# EAGLE design HFL Keep (EAGLE 9.6.2)
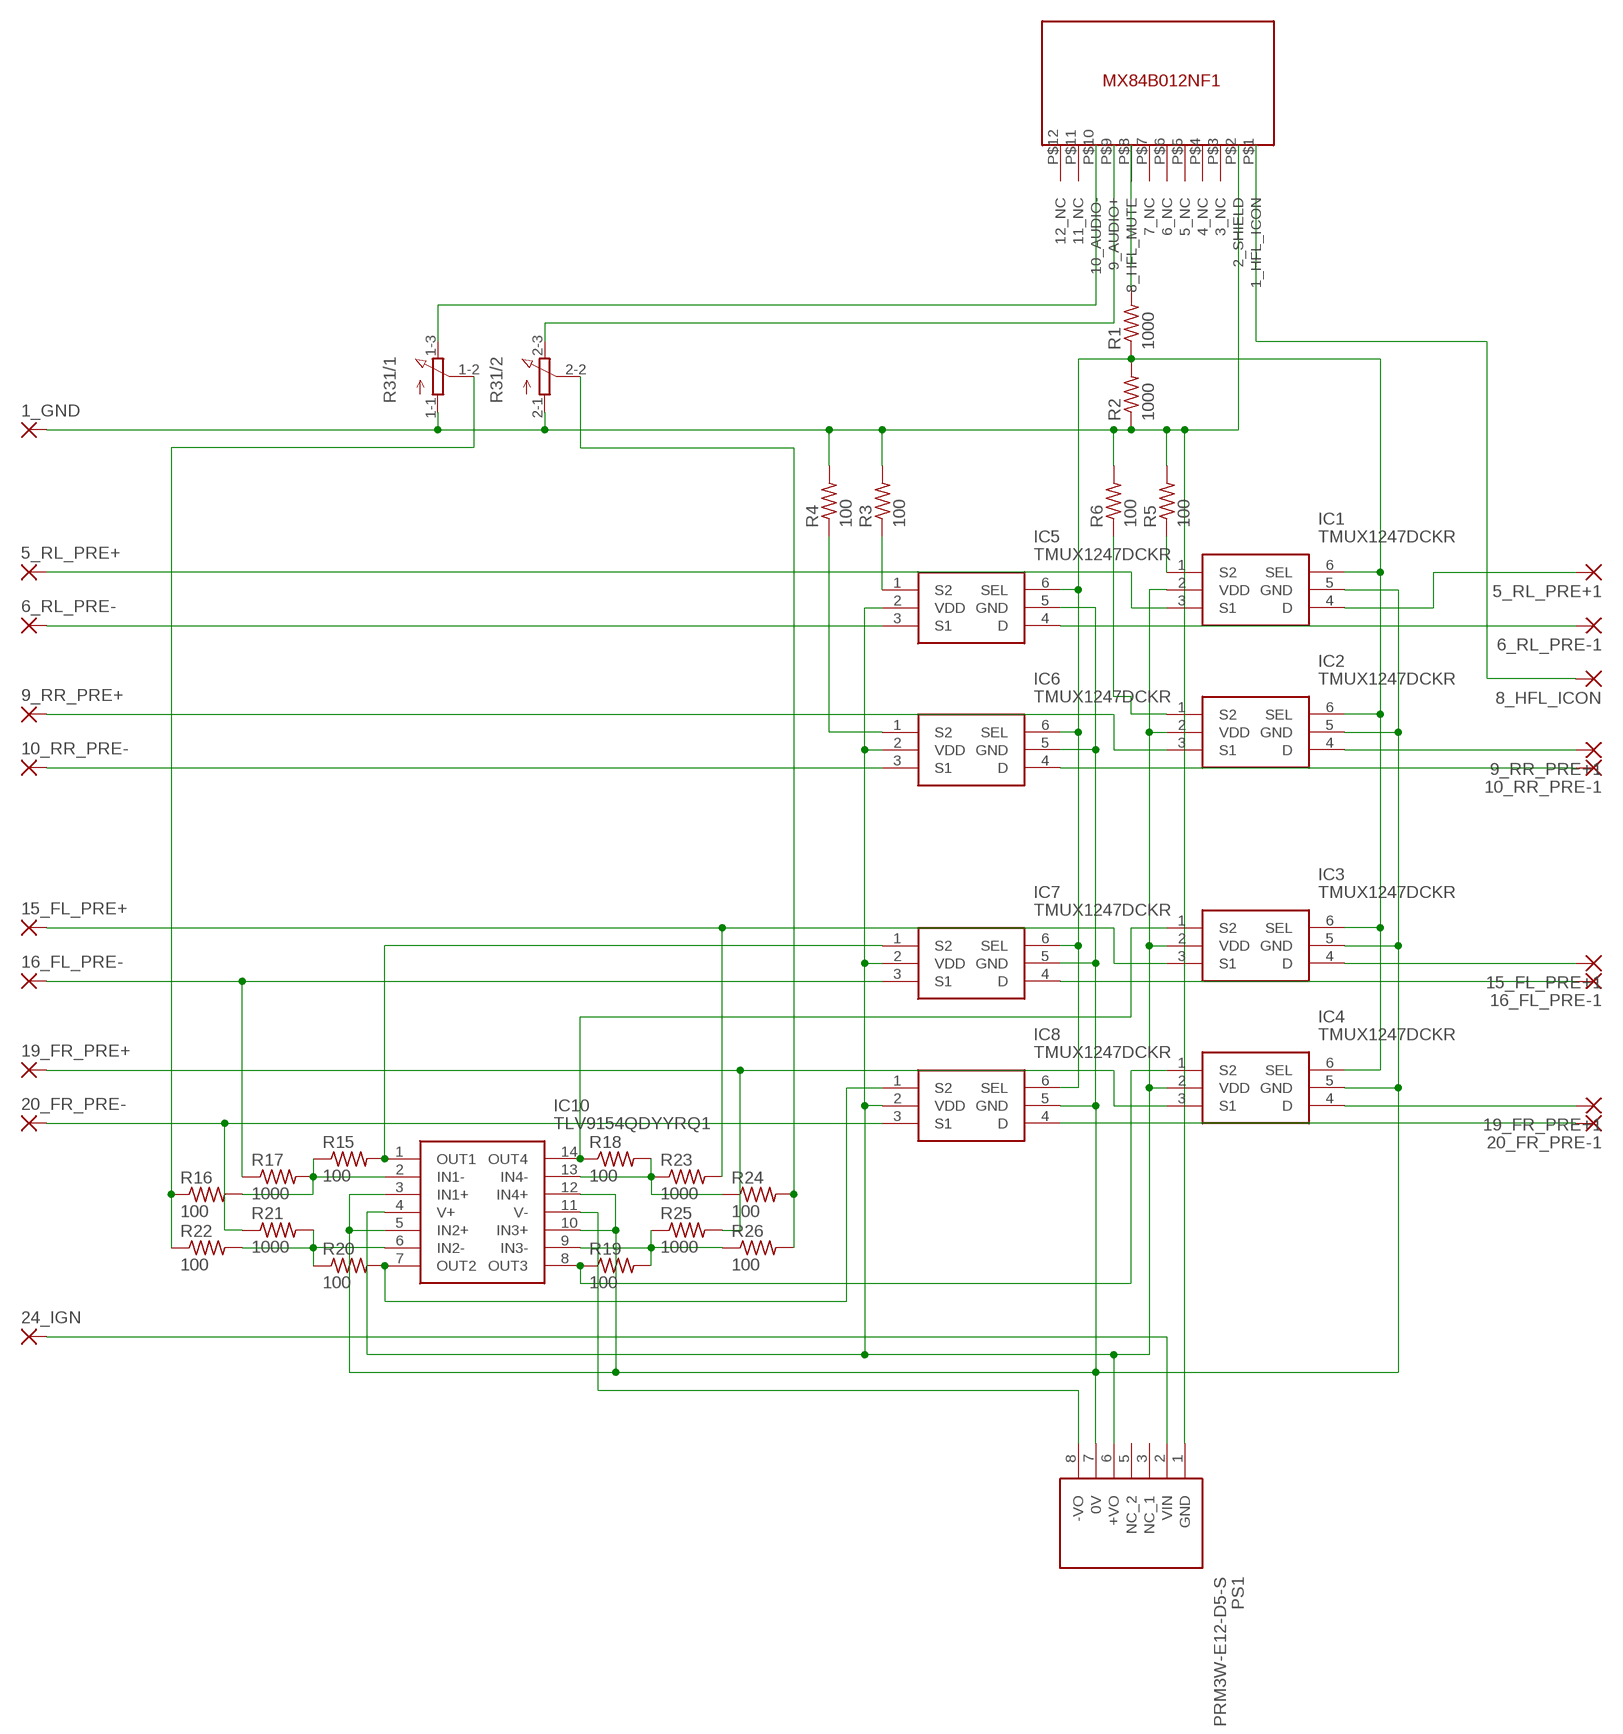
[diagram p0: schematic, sheet 1]

## Parts
1_GND  3,81/1,4  [3,81/1,4]
5_RL_PRE+  3,81/1,4  [3,81/1,4]
5_RL_PRE+1  3,81/1,4  [3,81/1,4]
6_RL_PRE-  3,81/1,4  [3,81/1,4]
6_RL_PRE-1  3,81/1,4  [3,81/1,4]
8_HFL_ICON  3,81/1,4  [3,81/1,4]
9_RR_PRE+  3,81/1,4  [3,81/1,4]
9_RR_PRE+1  3,81/1,4  [3,81/1,4]
10_RR_PRE-  3,81/1,4  [3,81/1,4]
10_RR_PRE-1  3,81/1,4  [3,81/1,4]
15_FL_PRE+  3,81/1,4  [3,81/1,4]
15_FL_PRE+1  3,81/1,4  [3,81/1,4]
16_FL_PRE-  3,81/1,4  [3,81/1,4]
16_FL_PRE-1  3,81/1,4  [3,81/1,4]
19_FR_PRE+  3,81/1,4  [3,81/1,4]
19_FR_PRE+1  3,81/1,4  [3,81/1,4]
20_FR_PRE-  3,81/1,4  [3,81/1,4]
20_FR_PRE-1  3,81/1,4  [3,81/1,4]
24_IGN  3,81/1,4  [3,81/1,4]
IC1  TMUX1247DCKR  [SOT65P210X110-6N]
IC2  TMUX1247DCKR  [SOT65P210X110-6N]
IC3  TMUX1247DCKR  [SOT65P210X110-6N]
IC4  TMUX1247DCKR  [SOT65P210X110-6N]
IC5  TMUX1247DCKR  [SOT65P210X110-6N]
IC6  TMUX1247DCKR  [SOT65P210X110-6N]
IC7  TMUX1247DCKR  [SOT65P210X110-6N]
IC8  TMUX1247DCKR  [SOT65P210X110-6N]
IC10  TLV9154QDYYRQ1  [SOP50P326X110-14N]
PS1  PRM3W-E12-D5-S  [PRM3WE12D5S]
R1  1000  R-US_0204/7  [0204/7]
R2  1000  R-US_0204/7  [0204/7]
R3  100  R-US_0204/7  [0204/7]
R4  100  R-US_0204/7  [0204/7]
R5  100  R-US_0204/7  [0204/7]
R6  100  R-US_0204/7  [0204/7]
R15  100  R-US_0204/7  [0204/7]
R16  100  R-US_0204/7  [0204/7]
R17  1000  R-US_0204/7  [0204/7]
R18  100  R-US_0204/7  [0204/7]
R19  100  R-US_0204/7  [0204/7]
R20  100  R-US_0204/7  [0204/7]
R21  1000  R-US_0204/7  [0204/7]
R22  100  R-US_0204/7  [0204/7]
R23  1000  R-US_0204/7  [0204/7]
R24  100  R-US_0204/7  [0204/7]
R25  1000  R-US_0204/7  [0204/7]
R26  100  R-US_0204/7  [0204/7]
R31  3RP/1610G  [3RP/1610G]
U$1  MX84B012NF1  [MX84B012NF1]

## Nets
N$1: 6_RL_PRE-1.1(P) IC5.4(D)
N$2: IC5.1(S2) R3.1
N$3: 1_GND.1(P) PS1.1(GND) R2.1 R3.2 R4.2 R5.2 R6.2 R31.1-1(/1:A) R31.2-1(/2:A) U$1.P$2(2_SHIELD)
N$4: IC6.1(S2) R4.1
N$5: IC2.1(S2) R6.1
N$6: 8_HFL_ICON.1(P) U$1.P$1(1_HFL_ICON)
N$7: IC1.1(S2) R5.1
N$8: 15_FL_PRE+.1(P) IC3.3(S1) R23.2
N$9: 5_RL_PRE+1.1(P) IC1.4(D)
N$10: IC1.6(SEL) IC2.6(SEL) IC3.6(SEL) IC4.6(SEL) IC5.6(SEL) IC6.6(SEL) IC7.6(SEL) IC8.6(SEL) R1.1 R2.2
N$11: 9_RR_PRE+1.1(P) IC2.4(D)
N$12: R16.1 R22.1 R31.1-2(/1:S)
N$13: IC1.2(VDD) IC2.2(VDD) IC3.2(VDD) IC4.2(VDD) IC5.2(VDD) IC6.2(VDD) IC7.2(VDD) IC8.2(VDD) IC10.4(V+) PS1.6(+VO)
N$16: 24_IGN.1(P) PS1.2(VIN)
N$17: 19_FR_PRE+.1(P) IC4.3(S1) R25.2
N$19: 20_FR_PRE-1.1(P) IC8.4(D)
N$20: 10_RR_PRE-.1(P) IC6.3(S1)
N$21: 20_FR_PRE-.1(P) IC8.3(S1) R21.1
N$22: IC10.11(V-) PS1.8(-VO)
N$24: 5_RL_PRE+.1(P) IC1.3(S1)
N$25: R31.2-3(/2:E) U$1.P$9(9_AUDIO+)
N$26: R24.2 R26.2 R31.2-2(/2:S)
N$30: 9_RR_PRE+.1(P) IC2.3(S1)
N$31: 15_FL_PRE+1.1(P) IC3.4(D)
N$32: 19_FR_PRE+1.1(P) IC4.4(D)
N$33: 16_FL_PRE-.1(P) IC7.3(S1) R17.1
N$34: 10_RR_PRE-1.1(P) IC6.4(D)
N$35: IC1.5(GND) IC2.5(GND) IC3.5(GND) IC4.5(GND) IC5.5(GND) IC6.5(GND) IC7.5(GND) IC8.5(GND) IC10.3(IN1+) IC10.5(IN2+) IC10.10(IN3+) IC10.12(IN4+) PS1.7(0V)
N$36: 16_FL_PRE-1.1(P) IC7.4(D)
N$37: 6_RL_PRE-.1(P) IC5.3(S1)
N$38: R31.1-3(/1:E) U$1.P$10(10_AUDIO-)
N$39: R1.2 U$1.P$8(8_HFL_MUTE)
N$41: IC10.2(IN1-) R15.1 R16.2 R17.2
N$42: IC7.1(S2) IC10.1(OUT1) R15.2
N$44: IC3.1(S2) IC10.14(OUT4) R18.1
N$45: IC4.1(S2) IC10.8(OUT3) R19.1
N$46: IC8.1(S2) IC10.7(OUT2) R20.2
N$47: IC10.9(IN3-) R19.2 R25.1 R26.1
N$48: IC10.6(IN2-) R20.1 R21.2 R22.2
N$49: IC10.13(IN4-) R18.2 R23.1 R24.1
Unconnected: PS1.3(NC_1) PS1.5(NC_2) U$1.P$3(3_NC) U$1.P$4(4_NC) U$1.P$5(5_NC) U$1.P$6(6_NC) U$1.P$7(7_NC) U$1.P$11(11_NC) U$1.P$12(12_NC)

## Library data of the parts
1_GND 5_RL_PRE+ 5_RL_PRE+1 6_RL_PRE- 6_RL_PRE-1 8_HFL_ICON 9_RR_PRE+ 9_RR_PRE+1 10_RR_PRE- 10_RR_PRE-1 15_FL_PRE+ 15_FL_PRE+1 16_FL_PRE- 16_FL_PRE-1 19_FR_PRE+ 19_FR_PRE+1 20_FR_PRE- 20_FR_PRE-1 24_IGN = wirepad:3,81/1,4: THROUGH-HOLE PAD
IC1-IC8 = SamacSys_Parts:TMUX1247DCKR: 1-ch, 2:1 general-purpose analog multiplexer with 1.8-V logic control Source: Datasheet <https://www.ti.com/lit/gpn/TMUX1247>; DESCRIPTION: 1-ch, 2:1 general-purpose analog multiplexer with 1.8-V logic control; HEIGHT: 1.1mm; MANUFACTURER_NAME: Texas Instruments; MANUFACTURER_PART_NUMBER: TMUX1247DCKR; MOUSER_PART_NUMBER: 595-TMUX1247DCKR; MOUSER_PRICE-STOCK: https://www.mouser.co.uk/ProductDetail/Texas-Instruments/TMUX1247DCKR?qs=XeJtXLiO41T%252BtWd1jD7ihA%3D%3D
IC10 = SamacSys_Parts:TLV9154QDYYRQ1: Operational Amplifiers - Op Amps Automotive-grade, quad, 16-V, 4.5-MHz, low-power operational amplifier Source: Datasheet <https://www.ti.com/lit/ds/symlink/tlv9154-q1.pdf?ts=1680312220649&ref_url=https%3A%2F%2Fwww.ti.com%2Fproduct%2FTLV9154-Q1%2Fpart-details%2FTLV9154QDYYRQ1>; DESCRIPTION: Operational Amplifiers - Op Amps Automotive-grade, quad, 16-V, 4.5-MHz, low-power operational amplifier; HEIGHT: 1.1mm; MANUFACTURER_NAME: Texas Instruments; MANUFACTURER_PART_NUMBER: TLV9154QDYYRQ1; MOUSER_PART_NUMBER: 595-TLV9154QDYYRQ1; MOUSER_PRICE-STOCK: https://www.mouser.co.uk/ProductDetail/Texas-Instruments/TLV9154QDYYRQ1?qs=A6eO%252BMLsxmTSdjIyNqTwdw%3D%3D
PS1 = SamacSys_Parts:PRM3W-E12-D5-S: Isolated DC/DC Converters 5 Vdc, 0.3 A, 3 W, 4.5 36 Vdc Input Range Source: Datasheet <https://www.cui.com/product/resource/digikeypdf/PRM3W-S.pdf>; DESCRIPTION: Isolated DC/DC Converters 5 Vdc, 0.3 A, 3 W, 4.5 36 Vdc Input Range; HEIGHT: 12.5mm; MANUFACTURER_NAME: CUI Inc.; MANUFACTURER_PART_NUMBER: PRM3W-E12-D5-S; MOUSER_PART_NUMBER: 490-PRM3W-E12-D5-S; MOUSER_PRICE-STOCK: https://www.mouser.co.uk/ProductDetail/CUI-Inc/PRM3W-E12-D5-S?qs=81r%252BiQLm7BS5MVpNLyuzoA%3D%3D
R1-R6 R15-R26 = rcl:R-US_: RESISTOR, American symbol; SPICEPREFIX: R
R31 = pot:3RP/1610G: 16mm Potentiometer two level Source: http://www.alphapotentiometers.net/html/16mm_pot_2.html
U$1 = Custom:MX84B012NF1

## Board
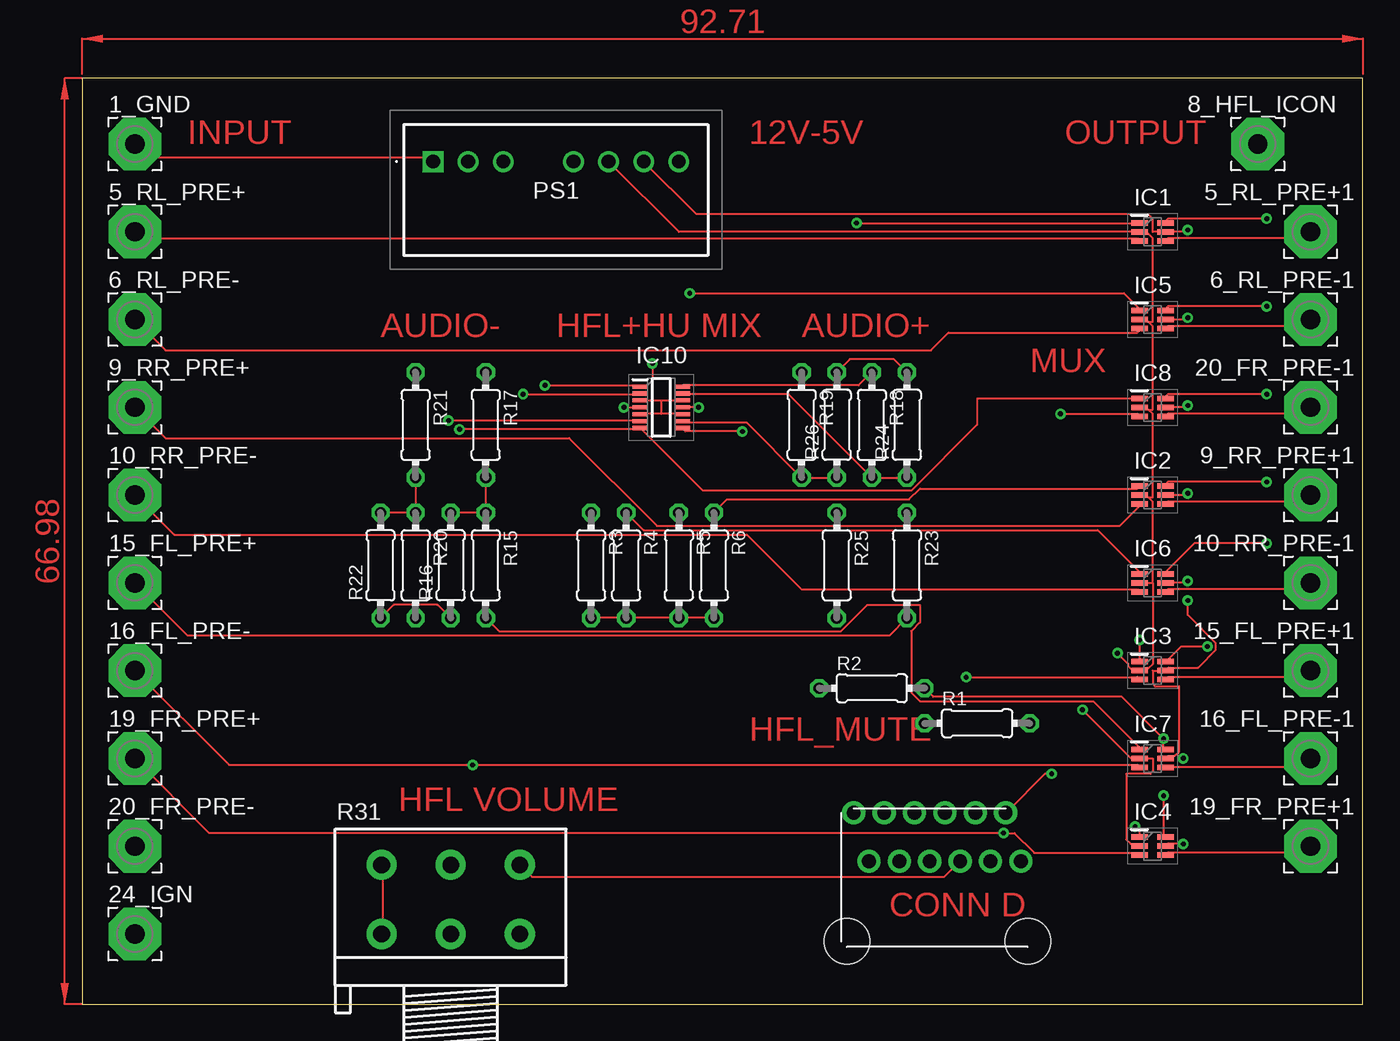
[diagram p1: board, top side]
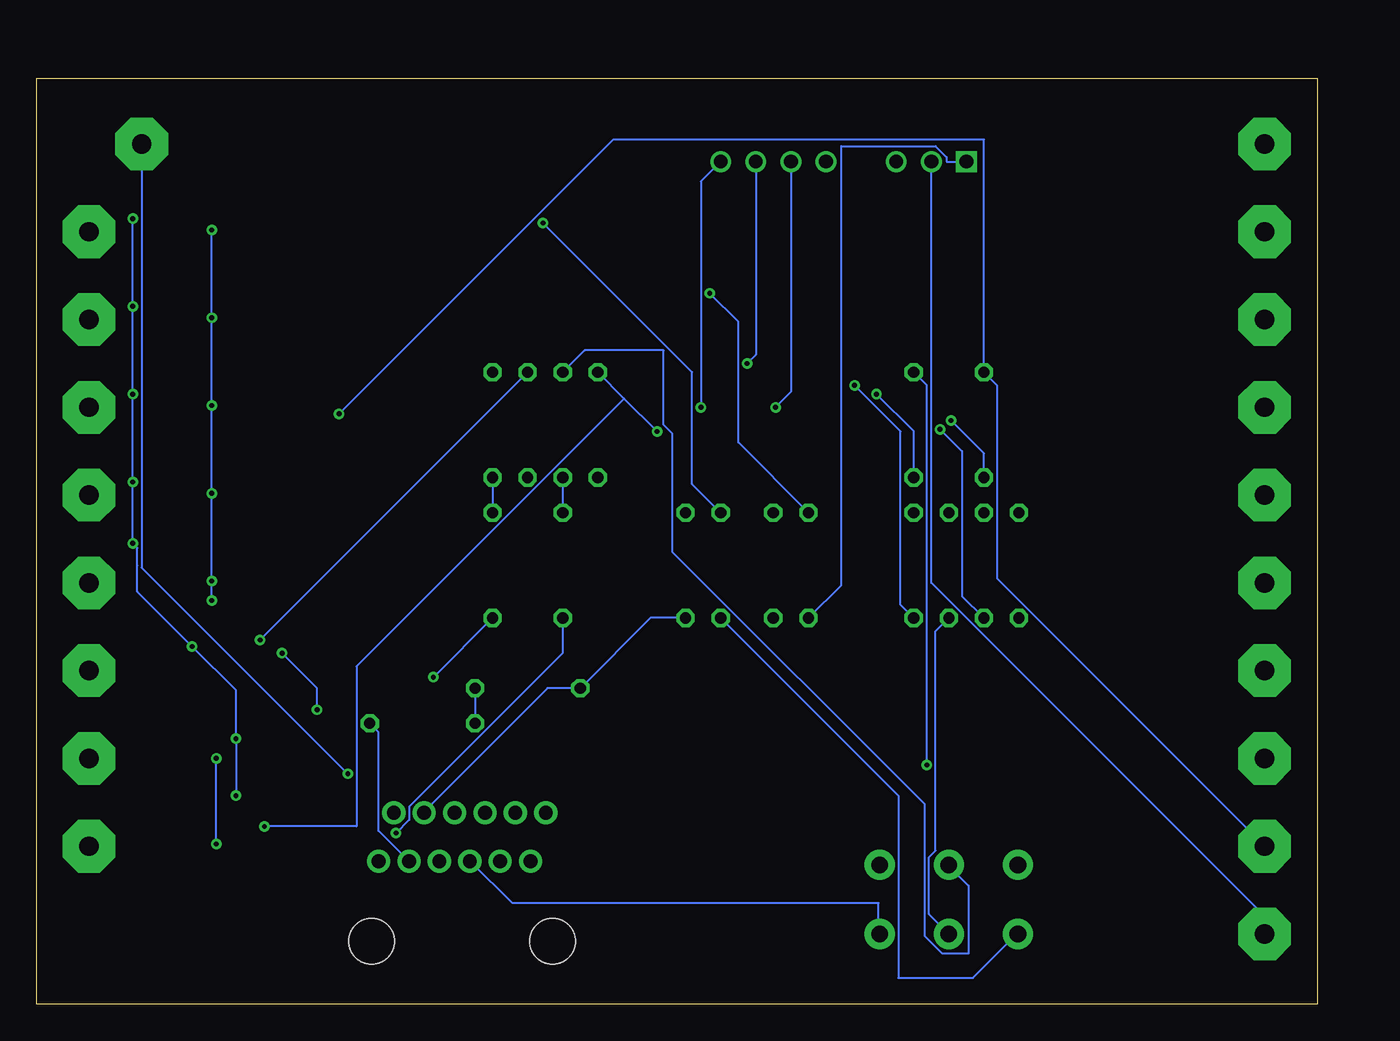
[diagram p2: board, bottom side, seen from below]

Size 92.69 x 66.98 mm. Coordinates in mm from the lower left corner, seen from the top.
Outline: 0,0 92.69,0 92.69,66.98 0,66.98 0,0
Copper layers (1*16): Top 0.035mm / dielectric 1.5mm / Bottom 0.035mm
Design rules "default *": minimum track width 6mil, minimum drill 0.35mm, track to track 6mil, track to pad 6mil, pad to pad 6mil, via to via 6mil, smd to smd 6mil, copper to edge 40mil, drill to drill 6mil, minimum pad ring 10mil, minimum via ring 8mil, stop-mask expansion 4mil, vias tented up to drill 0mil, thermal gap 10mil

### Footprints (pad centres in the part's own frame; a part is rotated, then mirrored left to right if it is on the bottom)
3,81/1,4 = drill 1.397 pad 3.81 octagon: 1 0,0
SOT65P210X110-6N = smd 1.2 x 0.4: 1 -0.95,0.65; 2 -0.95,0; 3 -0.95,-0.65; 4 0.95,-0.65; 5 0.95,0; 6 0.95,0.65
SOP50P326X110-14N = smd 1.075 x 0.3: 1 -1.538,1.5; 2 -1.538,1; 3 -1.538,0.5; 4 -1.538,0; 5 -1.538,-0.5; 6 -1.538,-1; 7 -1.538,-1.5; 8 1.538,-1.5; 9 1.538,-1; 10 1.538,-0.5; 11 1.538,0; 12 1.538,0.5; 13 1.538,1; 14 1.538,1.5
PRM3WE12D5S = drill 1 pad 1.5 square: 1 0,0 | drill 1 pad 1.5: 2 2.54,0; 3 5.08,0; 5 10.16,0; 6 12.7,0; 7 15.24,0; 8 17.78,0
0204/7 = drill 0.813 octagon: 1 -3.81,0; 2 3.81,0
3RP/1610G = drill 1.2 pad 2.184: 1-1 -5,0; 1-2 0,0; 1-3 5,0; 2-1 -5,5; 2-2 0,5; 2-3 5,5
MX84B012NF1 = drill 1 pad 1.676: P$1 13.5,11.3; P$2 11.3,11.3; P$3 9.1,11.3; P$4 6.9,11.3; P$5 4.7,11.3; P$6 2.5,11.3; P$7 14.6,7.8; P$8 12.4,7.8; P$9 10.2,7.8; P$10 8,7.8; P$11 5.8,7.8; P$12 3.6,7.8 | hole 3.3: 2,2; 15.1,2

### Placement (x,y rotation side)
1_GND  3.81,62.23 0 top
5_RL_PRE+  3.81,55.88 0 top
5_RL_PRE+1  88.9,55.88 0 top
6_RL_PRE-  3.81,49.53 0 top
6_RL_PRE-1  88.9,49.53 0 top
8_HFL_ICON  85.09,62.23 0 top
9_RR_PRE+  3.81,43.18 0 top
9_RR_PRE+1  88.9,36.83 0 top
10_RR_PRE-  3.81,36.83 0 top
10_RR_PRE-1  88.9,30.48 0 top
15_FL_PRE+  3.81,30.48 0 top
15_FL_PRE+1  88.9,24.13 0 top
16_FL_PRE-  3.81,24.13 0 top
16_FL_PRE-1  88.9,17.78 0 top
19_FR_PRE+  3.81,17.78 0 top
19_FR_PRE+1  88.9,11.43 0 top
20_FR_PRE-  3.81,11.43 0 top
20_FR_PRE-1  88.9,43.18 0 top
24_IGN  3.81,5.08 0 top
IC1  77.47,55.88 0 top
IC2  77.47,36.83 0 top
IC3  77.47,24.13 0 top
IC4  77.47,11.43 0 top
IC5  77.47,49.53 0 top
IC6  77.47,30.48 0 top
IC7  77.47,17.78 0 top
IC8  77.47,43.18 0 top
IC10  41.91,43.18 0 top
PS1  25.4,60.96 0 top
R1  64.77,20.32 0 top
R2  57.15,22.86 0 top
R3  36.83,31.75 270 top
R4  39.37,31.75 270 top
R5  43.18,31.75 270 top
R6  45.72,31.75 270 top
R15  29.21,31.75 270 top
R16  26.67,31.75 90 top
R17  29.21,41.91 270 top
R18  57.15,41.91 270 top
R19  52.07,41.91 270 top
R20  24.13,31.75 270 top
R21  24.13,41.91 270 top
R22  21.59,31.75 90 top
R23  59.69,31.75 270 top
R24  59.69,41.91 90 top
R25  54.61,31.75 270 top
R26  54.61,41.91 90 top
R31  26.67,5.08 0 top
U$1  53.34,2.54 0 top

### Tracks (layer width: path | path; a pad name or v marks a point on that pad's centre or on a via)
N$1
  Top 0.152: 6_RL_PRE-1.1 88.42,49.05 78.58,49.05 78.42,48.9 IC5.4
N$2  (via drill 0.35)
  Top 0.152: v43.97,51.44 75.41,51.44 76.52,50.32 IC5.1
  Bottom 0.152: v43.97,51.44 41.91,49.37 41.91,40.64 R3.1
N$3
  Top 0.152: PS1.1 25.08,61.28 4.76,61.28 1_GND.1 | R31.1-1 21.75,5.08 21.75,10 R31.2-1 | R3.2 R4.2 R5.2 R6.2
  Bottom 0.152: R6.2 48.26,27.94 R2.1 55.72,22.86 64.61,13.97 U$1.P$2 | R5.2 30.32,15.08 30.32,1.91 24.92,1.91 21.75,5.08 R31.1-1 | PS1.1 26.83,60.96 26.83,61.28 27.62,62.07 34.45,62.07 34.45,30.32 R3.2
N$4
  Top 0.152: R4.1 40.64,34.29 73.5,34.29 76.52,31.27 IC6.1
N$5
  Top 0.152: R6.1 46.67,36.51 59.85,36.51 60.64,37.31 76.36,37.31 76.52,37.47 IC2.1
N$6  (via drill 0.35)
  Top 0.152: v70.17,16.67 69.69,16.67 66.99,13.97 U$1.P$1
  Bottom 0.152: v70.17,16.67 85.09,31.59 8_HFL_ICON.1
N$7  (via drill 0.35)
  Top 0.152: v56.04,56.52 76.52,56.52 IC1.1
  Bottom 0.152: v56.04,56.52 45.24,45.72 45.24,37.62 R5.1
N$8  (via drill 0.35)
  Top 0.152: v63.98,23.65 76.36,23.65 76.52,23.5 IC3.3 | 15_FL_PRE+.1 7.62,26.67 58.42,26.67 R23.2
  Bottom 0.152: R23.2 v63.98,23.65
N$9
  Top 0.152: 5_RL_PRE+1.1 88.42,55.4 78.58,55.4 78.42,55.24 IC1.4
N$10  (via drill 0.35)
  Top 0.152: v78.26,15.08 78.26,12.22 IC4.6 | IC7.6 78.26,18.57 v78.26,19.21 75.25,22.23 61.59,22.23 R2.2 | v81.44,25.88 79.52,25.88 IC3.6 | v85.72,33.34 80.49,33.34 78.42,31.27 IC6.6 | v85.72,37.78 78.58,37.78 78.42,37.62 IC2.6 | v85.72,44.13 78.58,44.13 78.42,43.97 IC8.6 | v85.72,50.48 78.58,50.48 78.42,50.32 IC5.6 | v85.72,56.83 78.58,56.83 78.42,56.67 IC1.6
  Bottom 0.152: R2.2 R1.1 | v78.26,15.08 v78.26,19.21 78.26,22.7 v81.44,25.88 85.41,29.84 85.41,31.75 85.41,33.02 v85.72,33.34 v85.72,37.78 v85.72,44.13 v85.72,50.48 v85.72,56.83
N$11
  Top 0.152: 9_RR_PRE+1.1 88.42,36.35 78.58,36.35 78.42,36.2 IC2.4
N$12
  Top 0.152: R22.1 22.54,28.89 25.72,28.89 R16.1
  Bottom 0.152: R16.1 27.62,26.99 27.62,11.11 28.1,10.64 28.1,6.51 R31.1-2
N$13  (via drill 0.35)
  Top 0.152: v39.21,43.18 IC10.4 | IC4.2 76.36,11.59 75.88,11.59 75.56,11.91 75.56,16.67 77.31,16.67 77.47,16.83 77.47,17.78 IC7.2 75.91,17.78 v72.39,21.3 | 77.47,30.48 77.47,24.61 77.15,24.29 76.83,24.29 76.68,24.13 IC3.2 76.05,24.13 75.69,24.48 75.69,24.64 v74.93,25.4 | IC6.2 77.47,30.48 | 77.15,36.67 76.83,36.67 76.68,36.83 IC2.2 | 77.15,36.67 77.47,36.35 77.47,30.48 | 77.15,43.02 76.83,43.02 76.68,43.18 IC8.2 | 77.15,43.02 77.47,42.7 77.47,36.67 77.15,36.67 | 77.15,49.37 76.83,49.37 76.68,49.53 IC5.2 | 77.15,49.37 77.47,49.05 77.47,43.02 77.15,43.02 | 77.15,49.37 77.47,49.37 77.47,55.4 77.15,55.72 76.83,55.72 76.68,55.88 IC1.2 43.18,55.88 PS1.6
  Bottom 0.152: v39.21,43.18 38.1,44.29 PS1.6 | v72.39,21.3 72.39,22.86 v74.93,25.4
N$16
  Bottom 0.152: PS1.2 27.94,30.48 3.81,6.35 24_IGN.1
N$17  (via drill 0.35)
  Top 0.152: IC4.3 76.52,10.79 76.36,10.95 68.9,10.95 67.47,12.38 v66.67,12.38 9.21,12.38 19_FR_PRE+.1
  Bottom 0.152: v66.67,12.38 65.72,13.34 65.72,14.29 54.61,25.4 R25.2
N$19
  Top 0.152: 20_FR_PRE-1.1 88.42,42.7 78.58,42.7 78.42,42.55 IC8.4
N$20
  Top 0.152: 10_RR_PRE-.1 6.67,33.97 48.1,33.97 52.07,30 76.36,30 76.52,29.84 IC6.3
N$21  (via drill 0.35)
  Top 0.152: v70.8,42.7 76.36,42.7 76.52,42.55 IC8.3
  Bottom 0.152: v70.8,42.7 50.96,62.55 24.13,62.55 R21.1 23.18,44.77 23.18,30.8 20_FR_PRE-.1
N$22  (via drill 0.35)
  Top 0.152: v44.61,43.18 IC10.11
  Bottom 0.152: v44.61,43.18 44.61,59.53 PS1.8
N$24
  Top 0.152: 5_RL_PRE+.1 4.29,55.4 76.36,55.4 76.52,55.24 IC1.3
N$25
  Top 0.152: U$1.P$9 63.5,10.32 62.39,9.21 32.54,9.21 31.75,10 R31.2-3
N$26
  Top 0.152: R26.2 55.56,46.67 58.74,46.67 R24.2
  Bottom 0.152: R26.2 53.02,47.31 47.31,47.31 47.31,41.91 46.67,41.27 46.67,32.7 28.42,14.45 28.42,4.92 27.15,3.65 25.24,3.65 25.24,8.57 26.67,10 R31.2-2
N$30
  Top 0.152: 9_RR_PRE+.1 6.03,40.96 35.24,40.96 41.59,34.61 75.09,34.61 76.52,36.04 IC2.3
N$31
  Top 0.152: 15_FL_PRE+1.1 88.42,23.65 78.58,23.65 78.42,23.5 IC3.4
N$32
  Top 0.152: 19_FR_PRE+1.1 88.42,10.95 78.58,10.95 78.42,10.79 IC4.4
N$33  (via drill 0.35)
  Top 0.152: 16_FL_PRE-.1 10.64,17.3 v28.26,17.3 76.36,17.3 76.52,17.14 IC7.3
  Bottom 0.152: R17.1 28.26,44.77 v28.26,17.3
N$34
  Top 0.152: 10_RR_PRE-1.1 88.42,30 78.58,30 78.42,29.84 IC6.4
N$35  (via drill 0.35)
  Top 0.152: 41.91,42.7 43.34,42.7 IC10.10 | 41.91,42.7 40.48,42.7 IC10.5 | 41.91,43.66 43.34,43.66 IC10.12 | 41.91,43.66 41.27,43.66 | 41.27,43.66 40.48,43.66 IC10.3 | 41.91,43.66 41.91,42.7 | v41.27,46.35 41.27,43.66 | 79.22,18.1 79.38,18.26 79.38,23.02 77.63,23.02 77.47,23.18 77.47,24.13 IC3.5 78.64,24.35 80.77,24.35 82.05,25.62 82.05,26.13 80.01,28.16 v80.01,29.21 | 79.22,18.1 79.06,17.94 78.58,17.94 IC7.5 | v79.69,11.59 78.58,11.59 IC4.5 | 79.22,18.1 79.53,17.78 v79.69,17.78 | PS1.7 44.45,57.15 77.15,57.15 77.47,56.83 77.47,55.88 IC1.5 79.88,55.88 v80.01,56.01 | v80.01,30.61 79.88,30.48 IC6.5 | v80.01,43.31 79.88,43.18 IC8.5 | v80.01,49.66 79.88,49.53 IC5.5 | v80.01,36.96 79.88,36.83 IC2.5
  Bottom 0.152: v41.27,46.35 40.64,46.99 PS1.7 | v79.69,11.59 v79.69,17.78 | v80.01,29.21 v80.01,30.61 v80.01,36.96 v80.01,43.31 v80.01,49.66 v80.01,56.01
N$36
  Top 0.152: 16_FL_PRE-1.1 88.27,17.14 78.42,17.14 IC7.4
N$37
  Top 0.152: 6_RL_PRE-.1 6.03,47.31 61.44,47.31 62.71,48.58 76.36,48.58 76.52,48.74 IC5.3
N$38
  Bottom 0.152: U$1.P$10 61.28,10.32 58.26,7.3 31.75,7.3 31.75,5.08 R31.1-3
N$39
  Bottom 0.152: R1.2 67.94,19.68 67.94,12.54 65.88,10.48 U$1.P$8
N$41  (via drill 0.35)
  Top 0.152: R16.2 R15.1 R17.2 | v31.91,44.13 40.32,44.13 IC10.2
  Bottom 0.152: v31.91,44.13 29.21,41.43 R17.2
N$42  (via drill 0.35)
  Top 0.152: v33.5,44.77 40.32,44.77 IC10.1 | R15.2 30.16,26.99 54.93,26.99 56.83,28.89 60.64,28.89 60.64,27.62 60.01,26.99 60.01,22.54 60.64,21.91 73.18,21.91 76.52,18.57 IC7.1
  Bottom 0.152: v33.5,44.77 30.16,41.43 30.16,28.89 R15.2
N$44  (via drill 0.35)
  Top 0.152: R18.1 56.2,44.77 43.5,44.77 IC10.14 | v76.52,26.35 76.52,24.92 IC3.1
  Bottom 0.152: R18.1 v76.52,26.35
N$45  (via drill 0.35)
  Top 0.152: v47.78,41.43 43.66,41.43 43.5,41.59 IC10.8 | v76.2,12.86 76.52,12.86 76.52,12.22 IC4.1
  Bottom 0.152: R19.1 50.16,43.81 | 50.16,43.81 v47.78,41.43 | v76.2,12.86 69.53,12.86 69.53,24.45 50.16,43.81
N$46  (via drill 0.35)
  Top 0.152: IC8.1 76.52,43.81 64.77,43.81 64.77,41.91 60.01,37.15 44.93,37.15 40.48,41.59 IC10.7 40.32,41.59 v27.3,41.59
  Bottom 0.152: R20.2 25.72,29.53 25.72,40.01 v27.3,41.59
N$47
  Top 0.152: IC10.9 43.5,42.07 48.1,42.07 R19.2 R26.1
  Bottom 0.152: R26.1 R25.1
N$48  (via drill 0.35)
  Top 0.152: R22.2 R20.1 R21.2 | v26.51,42.23 40.32,42.23 IC10.6
  Bottom 0.152: v26.51,42.23 24.13,39.85 R21.2
N$49
  Top 0.152: IC10.13 43.5,44.13 51.12,44.13 R18.2 R24.1
  Bottom 0.152: R24.1 R23.1
(copper drawn outside any net)
  shapes: Top area x2

### Text on the board
Top: INPUT | 12V-5V | OUTPUT | AUDIO- | HFL+HU MIX | AUDIO+ | MUX | HFL_MUTE | HFL VOLUME | CONN D